# EAGLE design Schematics (EAGLE 8.0.0)

## Sheet 1 of 2
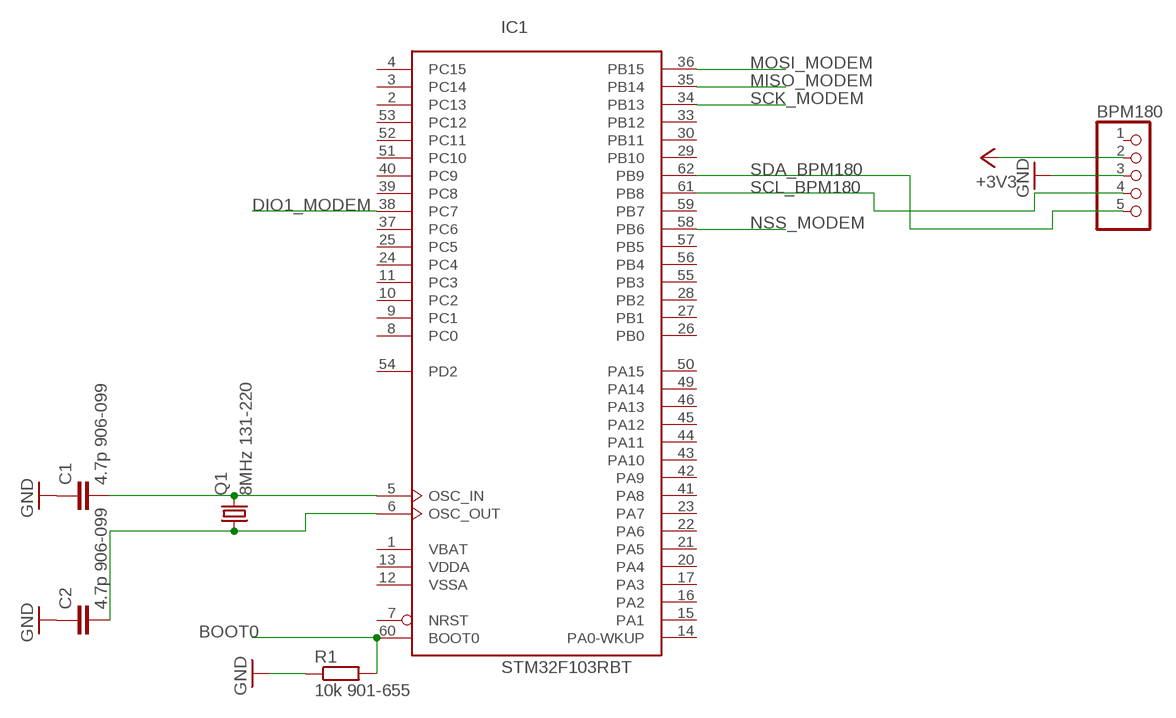
[diagram p0: schematic, sheet 1]

### Parts
BPM180  PINHD-1X5/90  [1X05/90]
C1  4.7p 906-099  C-EUC0805  [C0805]
C2  4.7p 906-099  C-EUC0805  [C0805]
IC1  STM32F103RBT  [LQFP64]
Q1  8MHz 131-220  CRYSTALHC49U-V  [HC49U-V]
R1  10k 901-655  R-EU_R0805  [R0805]

### Nets
+3V3: BPM180.2 ; also sheet 2
BOOT0: IC1.60(BOOT0) R1.2
DIO1_MODEM: IC1.38(PC7) ; also sheet 2
GND: BPM180.3 C1.1 C2.1 R1.1 ; also sheet 2
MISO_MODEM: IC1.35(PB14) ; also sheet 2
MOSI_MODEM: IC1.36(PB15) ; also sheet 2
N$1: C1.2 IC1.5(OSC_IN) Q1.2
N$2: C2.2 IC1.6(OSC_OUT) Q1.1
NSS_MODEM: IC1.58(PB6) ; also sheet 2
SCK_MODEM: IC1.34(PB13) ; also sheet 2
SCL_BPM180: BPM180.4 IC1.61(PB8)
SDA_BPM180: BPM180.5 IC1.62(PB9)
Unconnected: BPM180.1 IC1.2(PC13) IC1.3(PC14) IC1.4(PC15) IC1.7(NRST) IC1.8(PC0) IC1.9(PC1) IC1.10(PC2) IC1.11(PC3) IC1.14(PA0-WKUP) IC1.15(PA1) IC1.16(PA2) IC1.17(PA3) IC1.20(PA4) IC1.21(PA5) IC1.22(PA6) IC1.23(PA7) IC1.24(PC4) IC1.25(PC5) IC1.26(PB0) IC1.27(PB1) IC1.28(PB2) IC1.29(PB10) IC1.30(PB11) IC1.33(PB12) IC1.37(PC6) IC1.39(PC8) IC1.40(PC9) IC1.41(PA8) IC1.42(PA9) IC1.43(PA10) IC1.44(PA11) IC1.45(PA12) IC1.46(PA13) IC1.49(PA14) IC1.50(PA15) IC1.51(PC10) IC1.52(PC11) IC1.53(PC12) IC1.54(PD2) IC1.55(PB3) IC1.56(PB4) IC1.57(PB5) IC1.59(PB7)

## Sheet 2 of 2
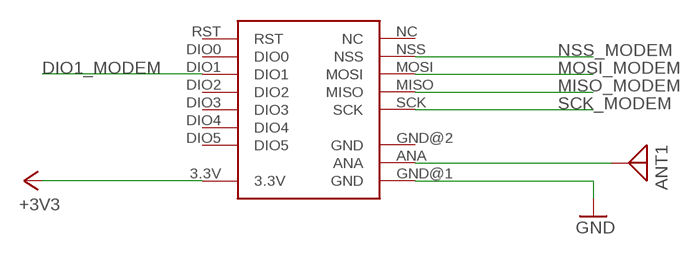
[diagram p1: schematic, sheet 2]

### Parts
ANT1  ANTENNA  [PAD-01]
U$1  RFM69  [20X16BOARD]

### Nets
+3V3: U$1.3.3V ; also sheet 1
DIO1_MODEM: U$1.DIO1 ; also sheet 1
GND: U$1.GND@1(GND) ; also sheet 1
MISO_MODEM: U$1.MISO ; also sheet 1
MOSI_MODEM: U$1.MOSI ; also sheet 1
N$3: ANT1.1 U$1.ANA
NSS_MODEM: U$1.NSS ; also sheet 1
SCK_MODEM: U$1.SCK ; also sheet 1
Unconnected: U$1.DIO0 U$1.DIO2 U$1.DIO3 U$1.DIO4 U$1.DIO5 U$1.RST

## Power pins joined to a net without a drawn wire
GND: U$1.GND@2(GND)
NC: U$1.NC
VBAT: IC1.1(VBAT)
VDD: IC1.19(VDD) IC1.32(VDD) IC1.48(VDD) IC1.64(VDD)
VDDA: IC1.13(VDDA)
VSS: IC1.18(VSS) IC1.31(VSS) IC1.47(VSS) IC1.63(VSS)
VSSA: IC1.12(VSSA)

## Library data of the parts
ANT1 = discrete:ANTENNA: Antenna
BPM180 = pinhead:PINHD-1X5: PIN HEADER
C1 C2 = rcl:C-EU: CAPACITOR, European symbol
IC1 = micro-stm_v3:STM32F103R*T: ARM 32-bit Cortex™-M3 CPU 72 MHz maximum frequency 16 to 1024 Kbytes of Flash memory 6 to 96 kbytes of SRAM 51 GPIOs 2.0 to 3.6 V application supply
Q1 = crystal:CRYSTAL: CRYSTAL; OC_FARNELL: 1666969; OC_NEWARK: unknown
R1 = rcl:R-EU_: RESISTOR, European symbol
U$1 = RFM69mod:RFM69: RFM69 module

## Board
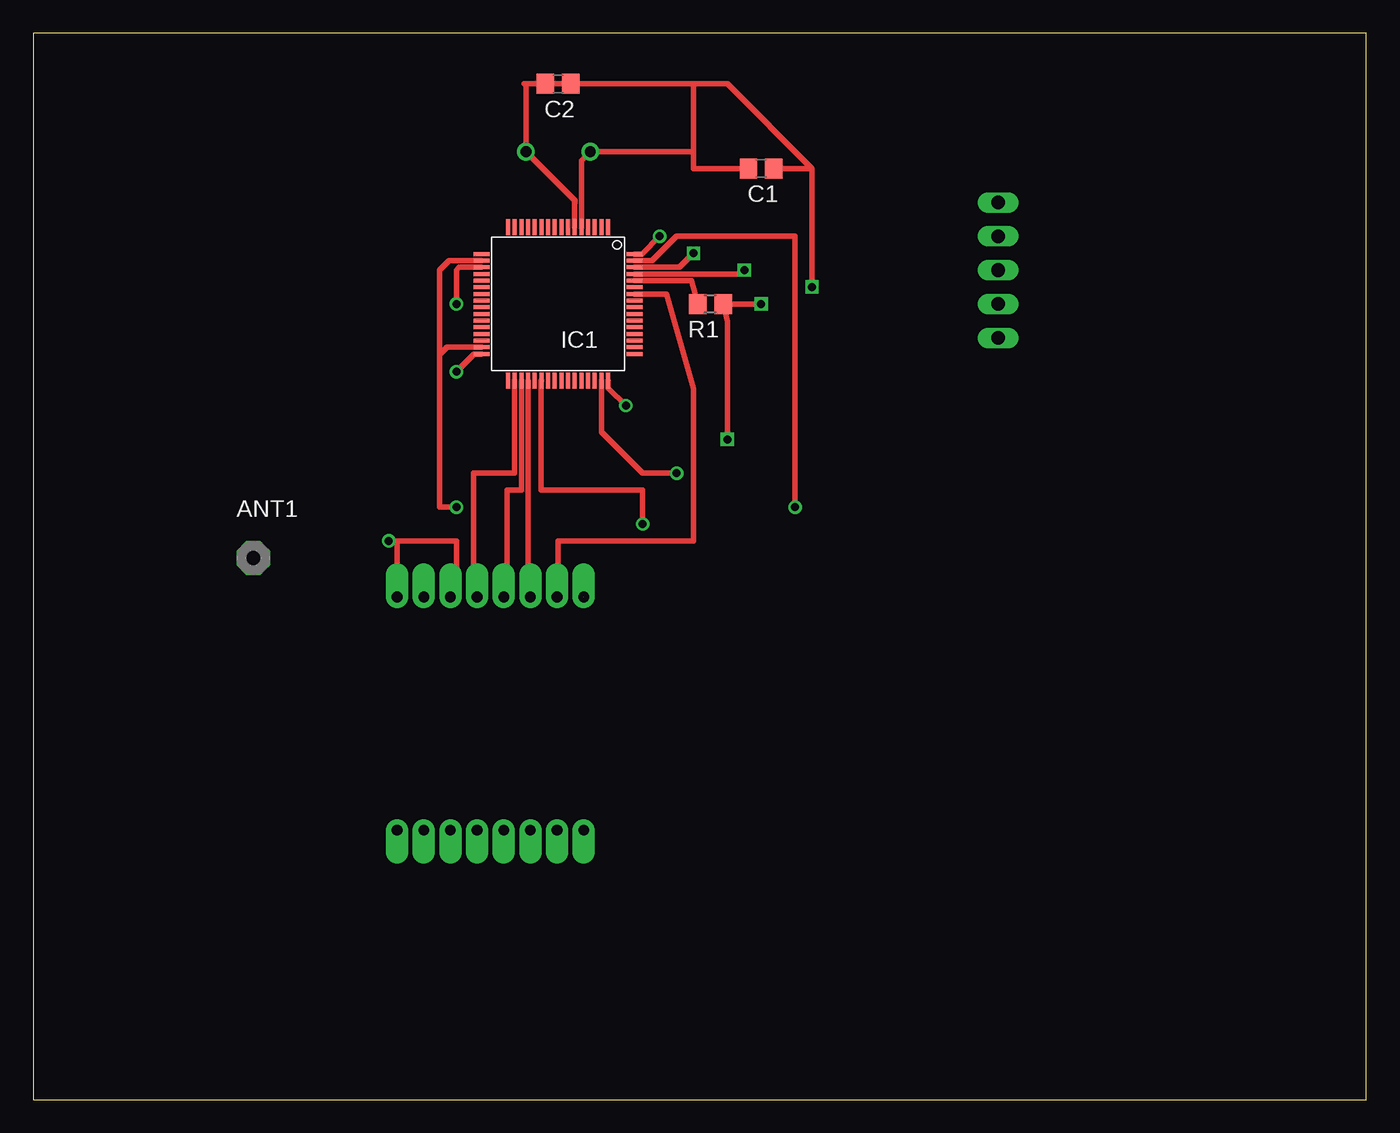
[diagram p2: board, top side]
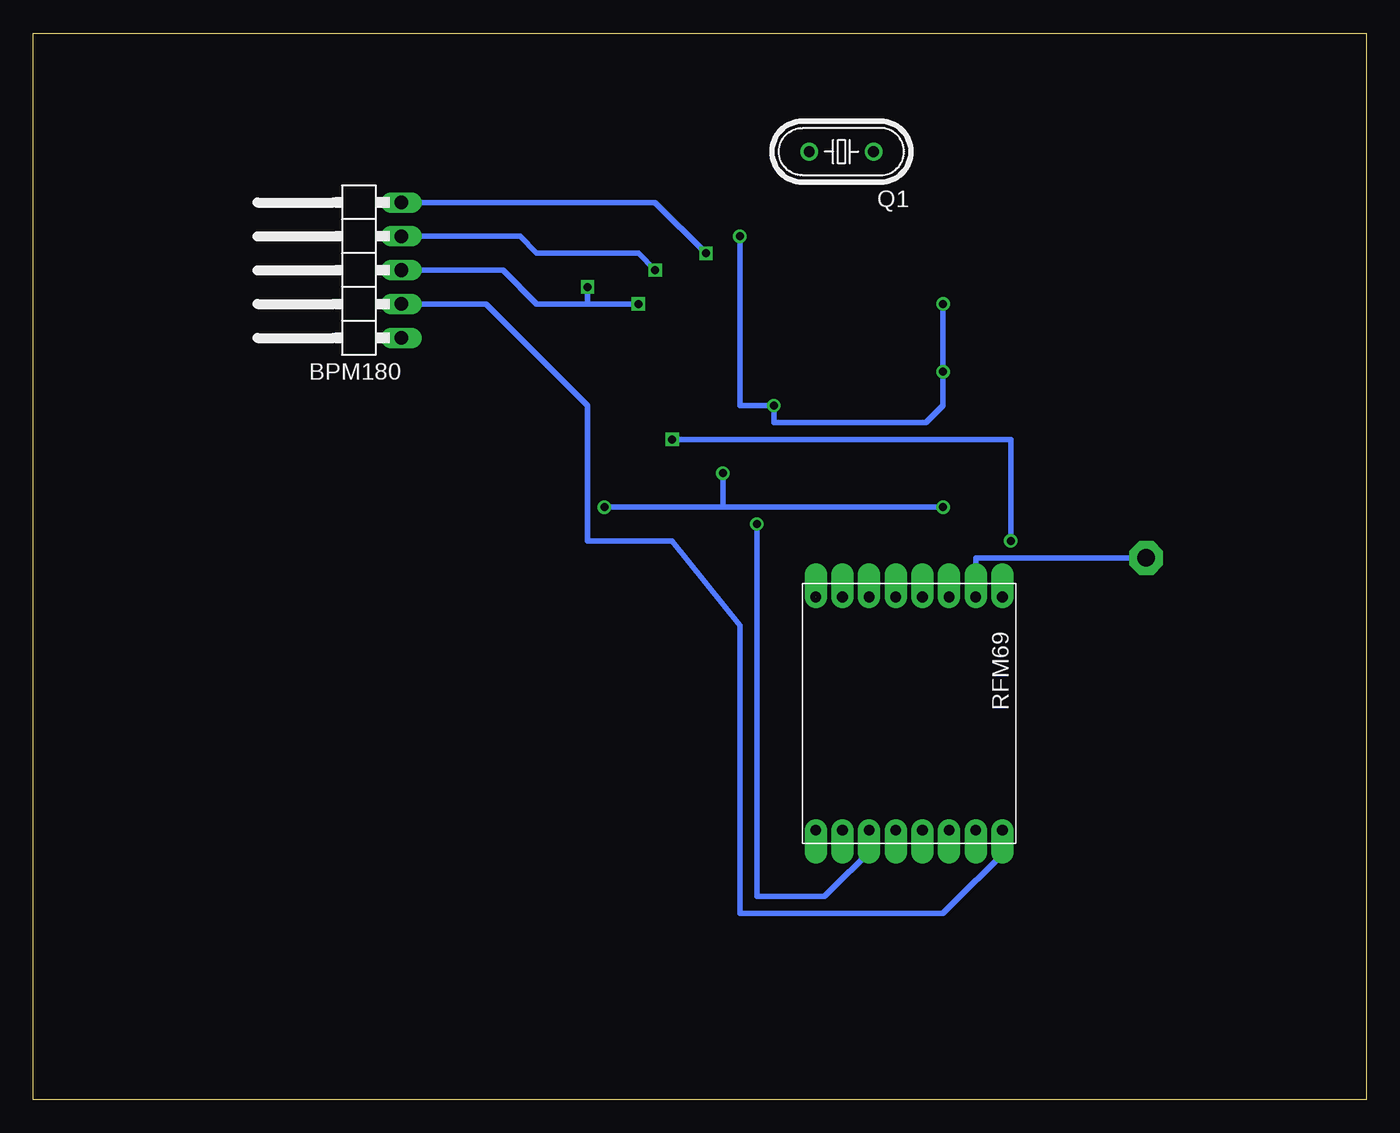
[diagram p3: board, bottom side, seen from below]

Size 100 x 80 mm. Coordinates in mm from the lower left corner, seen from the top.
Outline: 0,0 100,0 100,80 0,80 0,0
Copper layers (1*16): Top 0.035mm / dielectric 1.5mm / Bottom 0.035mm
Design rules "default": minimum track width 10mil, minimum drill 24mil, track to track 8mil, track to pad 8mil, pad to pad 8mil, via to via 8mil, smd to smd 8mil, copper to edge 40mil, drill to drill 8mil, minimum pad ring 10mil, minimum via ring 8mil, stop-mask expansion 4mil, vias tented up to drill 0mil, thermal gap 10mil

### Footprints (pad centres in the part's own frame; a part is rotated, then mirrored left to right if it is on the bottom)
PAD-01 = drill 1.321 pad 2.54 octagon: 1 0,0
1X05/90 = drill 1.016 long: 1 -5.08,-3.81; 2 -2.54,-3.81; 3 0,-3.81; 4 2.54,-3.81; 5 5.08,-3.81
C0805 = smd 1.3 x 1.5: 1 -0.95,0; 2 0.95,0
LQFP64 = smd 0.3 x 1.2: 1 -3.75,-5.75; 2 -3.25,-5.75; 3 -2.75,-5.75; 4 -2.25,-5.75; 5 -1.75,-5.75; 6 -1.25,-5.75; 7 -0.75,-5.75; 8 -0.25,-5.75; 9 0.25,-5.75; 10 0.75,-5.75; 11 1.25,-5.75; 12 1.75,-5.75; 13 2.25,-5.75; 14 2.75,-5.75; 15 3.25,-5.75; 16 3.75,-5.75; 33 3.75,5.75; 34 3.25,5.75; 35 2.75,5.75; 36 2.25,5.75; 37 1.75,5.75; 38 1.25,5.75; 39 0.75,5.75; 40 0.25,5.75; 41 -0.25,5.75; 42 -0.75,5.75; 43 -1.25,5.75; 44 -1.75,5.75; 45 -2.25,5.75; 46 -2.75,5.75; 47 -3.25,5.75; 48 -3.75,5.75 | smd 1.2 x 0.3: 17 5.75,-3.75; 18 5.75,-3.25; 19 5.75,-2.75; 20 5.75,-2.25; 21 5.75,-1.75; 22 5.75,-1.25; 23 5.75,-0.75; 24 5.75,-0.25; 25 5.75,0.25; 26 5.75,0.75; 27 5.75,1.25; 28 5.75,1.75; 29 5.75,2.25; 30 5.75,2.75; 31 5.75,3.25; 32 5.75,3.75; 49 -5.75,3.75; 50 -5.75,3.25; 51 -5.75,2.75; 52 -5.75,2.25; 53 -5.75,1.75; 54 -5.75,1.25; 55 -5.75,0.75; 56 -5.75,0.25; 57 -5.75,-0.25; 58 -5.75,-0.75; 59 -5.75,-1.25; 60 -5.75,-1.75; 61 -5.75,-2.25; 62 -5.75,-2.75; 63 -5.75,-3.25; 64 -5.75,-3.75
HC49U-V = drill 0.813: 1 -2.413,0; 2 2.413,0
R0805 = smd 1.3 x 1.5: 1 -0.95,0; 2 0.95,0
20X16BOARD = drill 0.8 pad 1.676 offset: 3.3V -9,-7; ANA 8.5,-5; DIO0 -9,5; DIO1 -9,3; DIO2 -9,1; DIO3 -9,-1; DIO4 -9,-3; DIO5 -9,-5; GND@1 8.5,-7; GND@2 8.5,-3; MISO 8.5,1; MOSI 8.5,3; NC 8.5,7; NSS 8.5,5; RST -9,7; SCK 8.5,-1

### Placement (x,y rotation side)
ANT1  16.51,40.64 0 top
BPM180  76.2,62.23 90 bottom
C1  54.61,69.85 180 top
C2  39.37,76.2 180 top
IC1  39.37,59.69 180 top
Q1  39.37,71.12 180 bottom
R1  50.8,59.69 180 top
U$1  34.29,29.21 90 bottom

### Tracks (layer width: path | path; a pad name or v marks a point on that pad's centre or on a via)
+3V3
  Bottom 0.406: BPM180.2 66.04,59.69 58.42,52.07 58.42,41.91 52.07,41.91 46.99,35.56 46.99,13.97 31.75,13.97 26.67,19.05 26.67,19.59 U$1.3.3V
BOOT0
  Top 0.406: IC1.60 49.37,61.44 R1.2
DIO1_MODEM  (via drill 0.6)
  Top 0.406: IC1.38 38.1,53.94 38.1,45.72 45.72,45.72 v45.72,43.18
  Bottom 0.406: v45.72,43.18 45.72,15.24 40.64,15.24 36.83,19.05 36.83,19.75 U$1.DIO1
GND  (via drill 0.6)
  Top 0.406: U$1.GND@2 31.75,37.71 31.75,41.91 v26.67,41.91 27.29,41.91 U$1.GND@1 | v52.07,49.53 52.07,58.42 R1.1 v54.61,59.69 | 58.42,69.85 C1.1 | 58.42,69.85 v58.42,60.96 | C2.1 52.07,76.2 58.42,69.85
  Bottom 0.406: v52.07,49.53 26.67,49.53 v26.67,41.91 | v54.61,59.69 58.42,59.69 | 58.42,59.69 62.23,59.69 64.77,62.23 BPM180.3 | 58.42,59.69 v58.42,60.96
MISO_MODEM
  Top 0.406: U$1.MISO 35.56,37.71 35.56,45.72 36.62,45.72 IC1.35
MOSI_MODEM
  Top 0.406: U$1.MOSI 37.12,37.71 IC1.36
N$1
  Top 0.406: Q1.2 41.91,71.12 | Q1.2 49.53,71.12 49.53,69.85 C1.2 | IC1.5 41.12,70.46 Q1.2
N$2
  Top 0.406: 49.53,71.12 49.53,76.2 C2.2 36.83,76.2 36.96,76.2 Q1.1 40.64,67.44 40.64,67.31 40.62,67.29 IC1.6
N$3
  Bottom 0.406: ANT1.1 29.29,40.64 U$1.ANA
NC  (1 unrouted)
NSS_MODEM
  Top 0.406: U$1.NSS 39.37,37.71 39.37,41.91 49.53,41.91 49.53,53.34 47.51,60.44 IC1.58
SCK_MODEM
  Top 0.406: U$1.SCK 33.02,37.71 33.02,46.99 36.12,46.99 IC1.34
SCL_BPM180  (via drill 0.6)
  Top 0.406: IC1.61 53.05,61.94 v53.34,62.23
  Bottom 0.406: v53.34,62.23 54.61,63.5 62.23,63.5 63.5,64.77 BPM180.4
SDA_BPM180  (via drill 0.6)
  Top 0.406: IC1.62 48.47,62.44 v49.53,63.5
  Bottom 0.406: v49.53,63.5 53.34,67.31 BPM180.5
VDD  (via drill 0.6)
  Top 0.406: IC1.48 43.12,53.4 v44.45,52.07 | IC1.64 45.66,63.44 v46.99,64.77 | IC1.19 31.96,62.44 31.75,62.23 v31.75,59.69 | IC1.32 33.08,55.94 v31.75,54.61
  Bottom 0.406: v46.99,64.77 46.99,52.07 v44.45,52.07 44.45,50.8 33.02,50.8 31.75,52.07 v31.75,54.61 v31.75,59.69
VSS  (via drill 0.6)
  Top 0.406: IC1.18 31.19,62.94 30.48,62.23 30.48,55.88 | v31.75,44.45 30.48,44.45 30.48,55.88 | v57.15,44.45 57.15,64.77 48.26,64.77 46.43,62.94 IC1.63 | IC1.47 42.62,50.09 45.72,46.99 v48.26,46.99 | IC1.31 31.04,56.44 30.48,55.88
  Bottom 0.406: 48.26,44.45 v57.15,44.45 | 48.26,44.45 v31.75,44.45 | v48.26,46.99 48.26,44.45